# EAGLE schematic D2K_V1 (EAGLE 9.6.2)

## Sheet 1 of 3
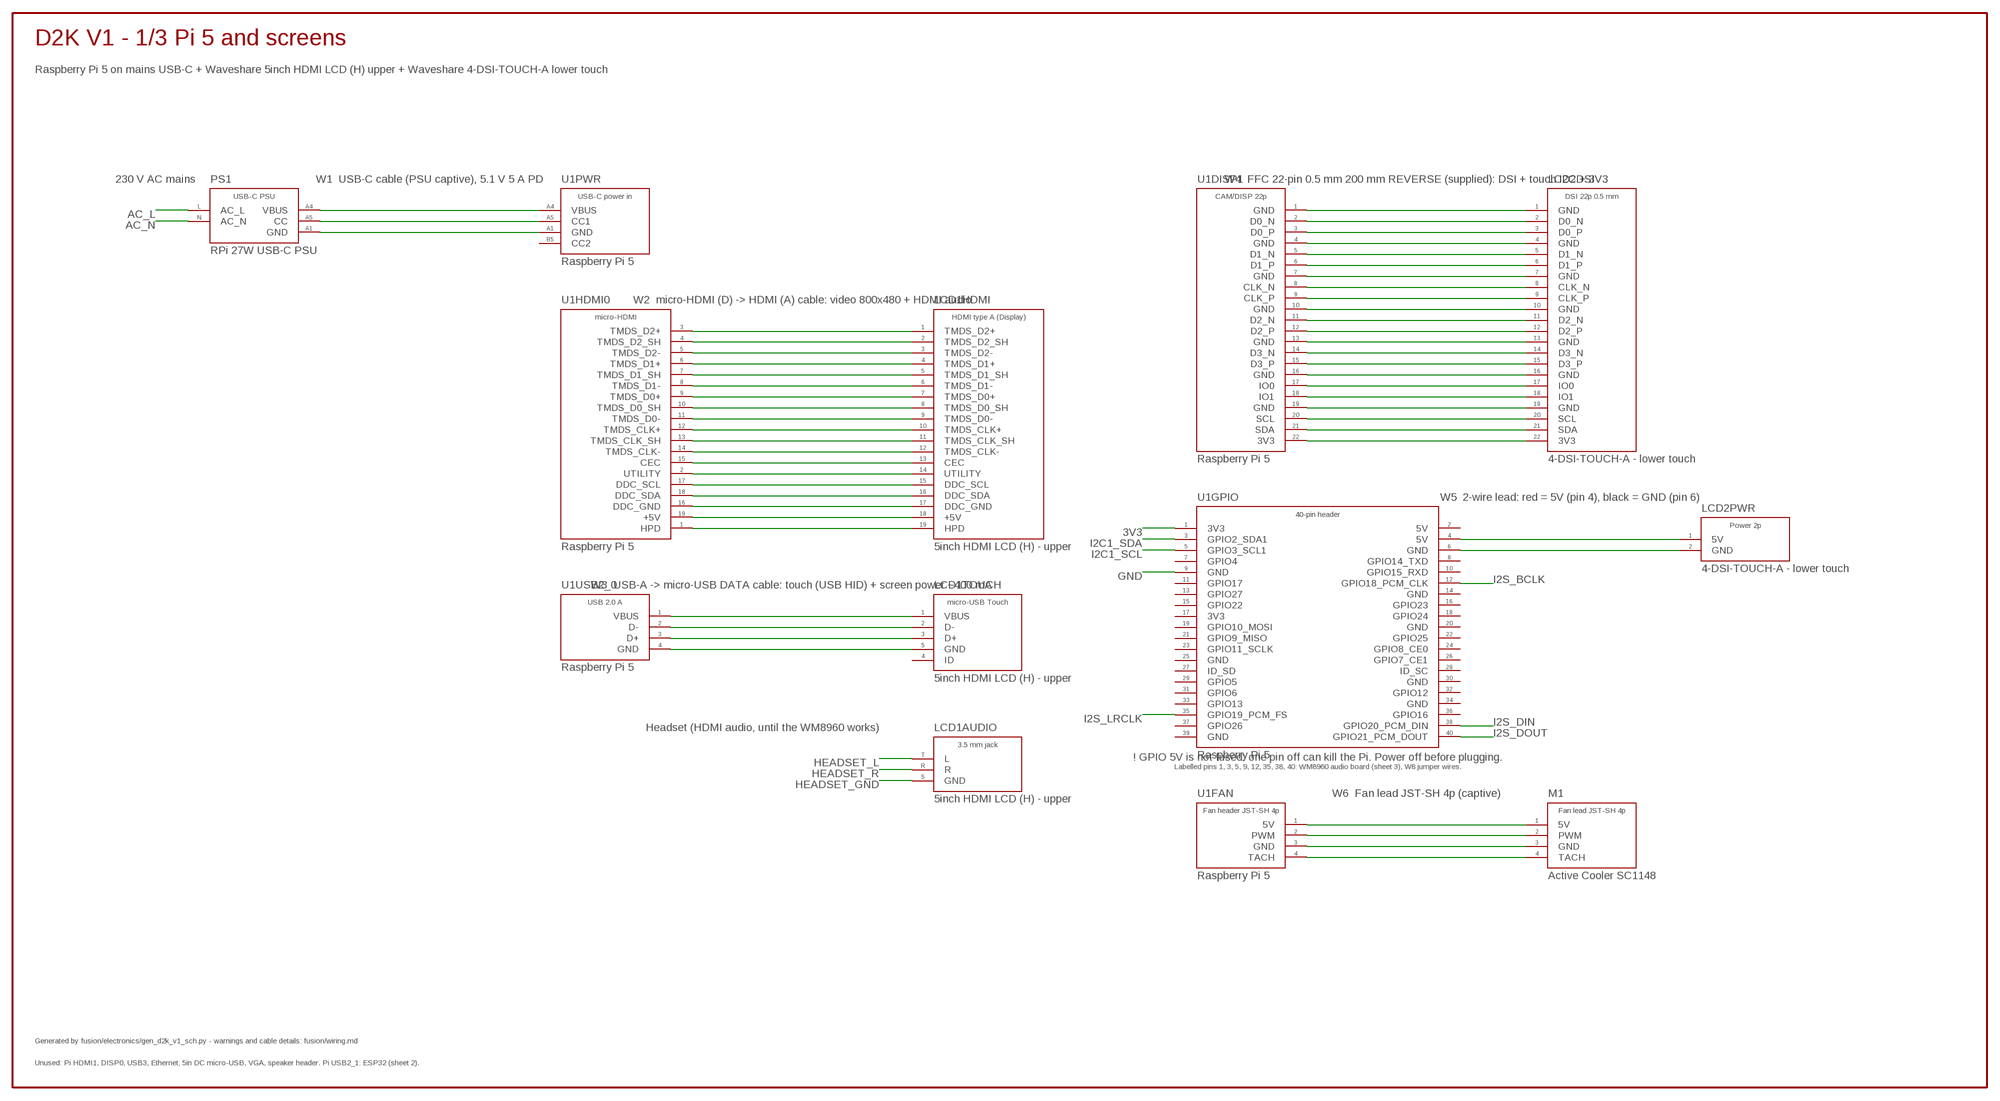
[diagram p0: schematic, sheet 1]

### Parts
LCD1  5inch HDMI LCD (H) - upper  WAVESHARE_5IN_HDMI_LCD_H  (no package)
LCD2  4-DSI-TOUCH-A - lower touch  WAVESHARE_4_DSI_TOUCH_A  (no package)
M1  Active Cooler SC1148  RPI5_ACTIVE_COOLER  (no package)
PS1  RPi 27W USB-C PSU  PSU_USBC_27W  (no package)
U1  Raspberry Pi 5  RASPBERRY_PI_5  (no package)

### Nets
3V3: LCD2.3V3 U1.3V3 ; also sheet 3
5V: LCD2.5V U1.5V
AC_L: PS1.AC_L
AC_N: PS1.AC_N
DSI1_CLK_N: LCD2.CLK_N U1.CLK_N
DSI1_CLK_P: LCD2.CLK_P U1.CLK_P
DSI1_D0_N: LCD2.D0_N U1.D0_N
DSI1_D0_P: LCD2.D0_P U1.D0_P
DSI1_D1_N: LCD2.D1_N U1.D1_N
DSI1_D1_P: LCD2.D1_P U1.D1_P
DSI1_D2_N: LCD2.D2_N U1.D2_N
DSI1_D2_P: LCD2.D2_P U1.D2_P
DSI1_D3_N: LCD2.D3_N U1.D3_N
DSI1_D3_P: LCD2.D3_P U1.D3_P
DSI1_IO0: LCD2.IO0 U1.IO0
DSI1_IO1: LCD2.IO1 U1.IO1
DSI1_SCL: LCD2.SCL U1.SCL
DSI1_SDA: LCD2.SDA U1.SDA
FAN_5V: M1.5V U1.5V
FAN_PWM: M1.PWM U1.PWM
FAN_TACH: M1.TACH U1.TACH
GND: LCD1.DDC_GND LCD1.GND LCD1.TMDS_CLK_SH LCD1.TMDS_D0_SH LCD1.TMDS_D1_SH LCD1.TMDS_D2_SH LCD2.GND M1.GND PS1.GND U1.DDC_GND U1.GND U1.TMDS_CLK_SH U1.TMDS_D0_SH U1.TMDS_D1_SH U1.TMDS_D2_SH ; also sheet 2,3
HDMI0_+5V: LCD1.+5V U1.+5V
HDMI0_CEC: LCD1.CEC U1.CEC
HDMI0_DDC_SCL: LCD1.DDC_SCL U1.DDC_SCL
HDMI0_DDC_SDA: LCD1.DDC_SDA U1.DDC_SDA
HDMI0_HPD: LCD1.HPD U1.HPD
HDMI0_TMDS_CLK+: LCD1.TMDS_CLK+ U1.TMDS_CLK+
HDMI0_TMDS_CLK-: LCD1.TMDS_CLK- U1.TMDS_CLK-
HDMI0_TMDS_D0+: LCD1.TMDS_D0+ U1.TMDS_D0+
HDMI0_TMDS_D0-: LCD1.TMDS_D0- U1.TMDS_D0-
HDMI0_TMDS_D1+: LCD1.TMDS_D1+ U1.TMDS_D1+
HDMI0_TMDS_D1-: LCD1.TMDS_D1- U1.TMDS_D1-
HDMI0_TMDS_D2+: LCD1.TMDS_D2+ U1.TMDS_D2+
HDMI0_TMDS_D2-: LCD1.TMDS_D2- U1.TMDS_D2-
HDMI0_UTILITY: LCD1.UTILITY U1.UTILITY
HEADSET_GND: LCD1.GND
HEADSET_L: LCD1.L
HEADSET_R: LCD1.R
I2C1_SCL: U1.GPIO3_SCL1 ; also sheet 3
I2C1_SDA: U1.GPIO2_SDA1 ; also sheet 3
I2S_BCLK: U1.GPIO18_PCM_CLK ; also sheet 3
I2S_DIN: U1.GPIO20_PCM_DIN ; also sheet 3
I2S_DOUT: U1.GPIO21_PCM_DOUT ; also sheet 3
I2S_LRCLK: U1.GPIO19_PCM_FS ; also sheet 3
USB2_0_D+: LCD1.D+ U1.D+
USB2_0_D-: LCD1.D- U1.D-
USB2_0_VBUS: LCD1.VBUS U1.VBUS
USBC_CC: PS1.CC U1.CC1
VBUS_5V1: PS1.VBUS U1.VBUS
Unconnected: LCD1.GND LCD1.ID LCD1.SPK1 LCD1.SPK2 LCD1.SPK3 LCD1.SPK4 LCD1.VBUS U1.3V3 U1.5V U1.+5V U1.CC2 U1.CEC U1.CLK_N U1.CLK_P U1.D0_N U1.D0_P U1.D1_N U1.D1_P U1.D2_N U1.D2_P U1.D3_N U1.D3_P U1.D+ U1.D- U1.DDC_GND U1.DDC_SCL U1.DDC_SDA U1.GND U1.GND_DRAIN U1.GPIO4 U1.GPIO5 U1.GPIO6 U1.GPIO7_CE1 U1.GPIO8_CE0 U1.GPIO9_MISO U1.GPIO10_MOSI U1.GPIO11_SCLK U1.GPIO12 U1.GPIO13 U1.GPIO14_TXD U1.GPIO15_RXD U1.GPIO16 U1.GPIO17 U1.GPIO22 U1.GPIO23 U1.GPIO24 U1.GPIO25 U1.GPIO26 U1.GPIO27 U1.HPD U1.ID_SC U1.ID_SD U1.IO0 U1.IO1 U1.SCL U1.SDA U1.SSRX+ U1.SSRX- U1.SSTX+ U1.SSTX- U1.TMDS_CLK+ U1.TMDS_CLK- U1.TMDS_CLK_SH U1.TMDS_D0+ U1.TMDS_D0- U1.TMDS_D0_SH U1.TMDS_D1+ U1.TMDS_D1- U1.TMDS_D1_SH U1.TMDS_D2+ U1.TMDS_D2- U1.TMDS_D2_SH U1.UTILITY U1.VBUS

### Notes on the sheet
- D2K V1 - 1/3 Pi 5 and screens
- Raspberry Pi 5 on mains USB-C + Waveshare 5inch HDMI LCD (H) upper + Waveshare 4-DSI-TOUCH-A lower touch
- 230 V AC mains | W1  USB-C cable (PSU captive), 5.1 V 5 A PD | W4  FFC 22-pin 0.5 mm 200 mm REVERSE (supplied): DSI + touch I2C + 3V3
- W2  micro-HDMI (D) -> HDMI (A) cable: video 800x480 + HDMI audio
- W5  2-wire lead: red = 5V (pin 4), black = GND (pin 6)
- W3  USB-A -> micro-USB DATA cable: touch (USB HID) + screen power ~400 mA
- Headset (HDMI audio, until the WM8960 works)
- ! GPIO 5V is not fused: one pin off can kill the Pi. Power off before plugging.
- Labelled pins 1, 3, 5, 9, 12, 35, 38, 40: WM8960 audio board (sheet 3), W8 jumper wires.
- W6  Fan lead JST-SH 4p (captive)
- Generated by fusion/electronics/gen_d2k_v1_sch.py - warnings and cable details: fusion/wiring.md
- Unused: Pi HDMI1, DISP0, USB3, Ethernet; 5in DC micro-USB, VGA, speaker header. Pi USB2_1: ESP32 (sheet 2).

## Sheet 2 of 3
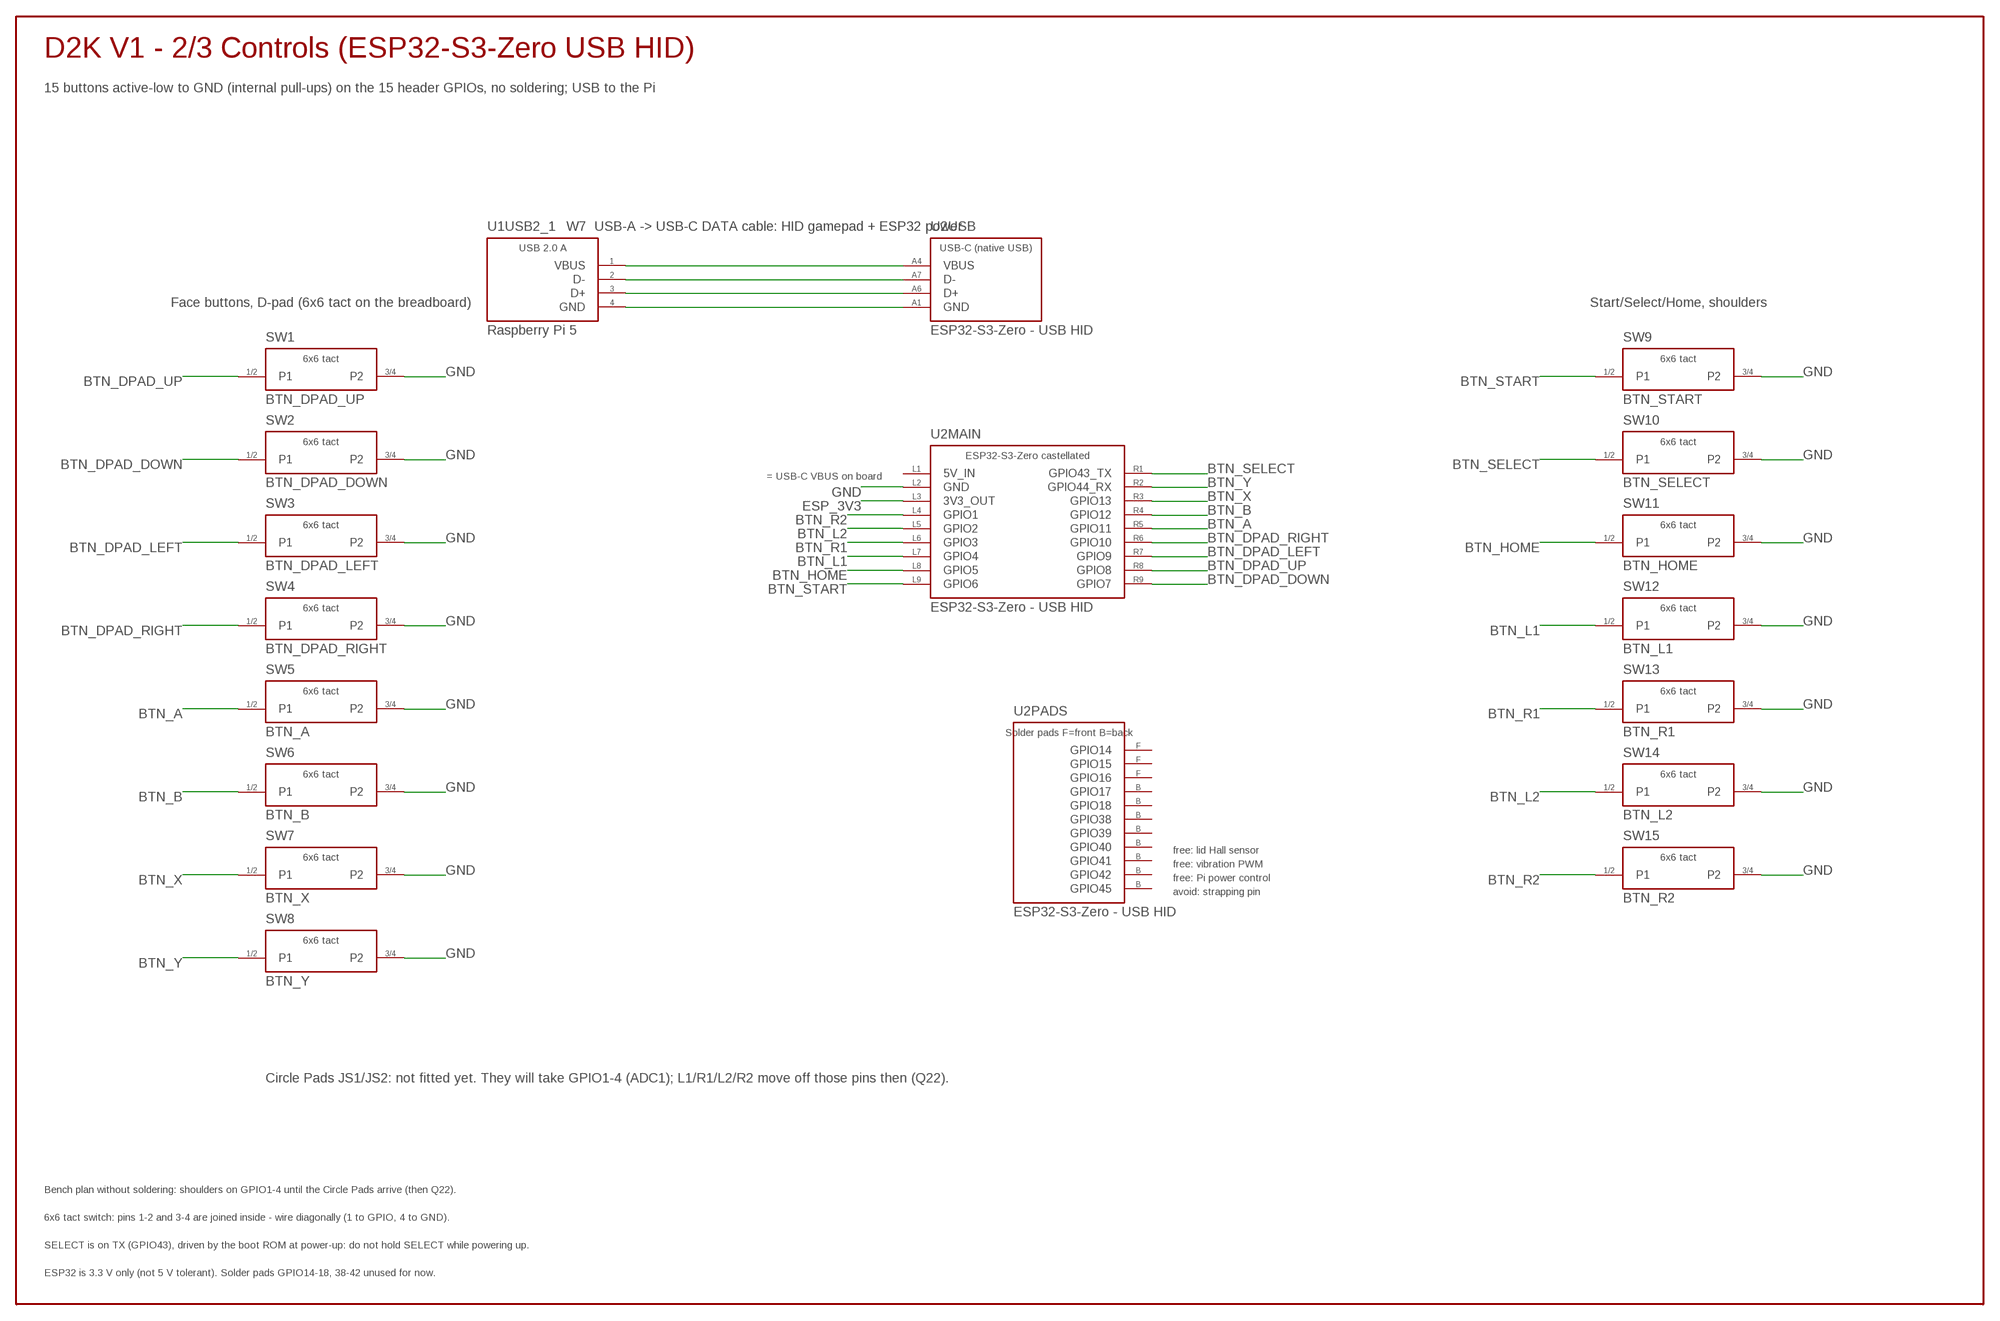
[diagram p1: schematic, sheet 2]

### Parts
SW1  BTN_DPAD_UP  TACT_SWITCH_6X6  (no package)
SW2  BTN_DPAD_DOWN  TACT_SWITCH_6X6  (no package)
SW3  BTN_DPAD_LEFT  TACT_SWITCH_6X6  (no package)
SW4  BTN_DPAD_RIGHT  TACT_SWITCH_6X6  (no package)
SW5  BTN_A  TACT_SWITCH_6X6  (no package)
SW6  BTN_B  TACT_SWITCH_6X6  (no package)
SW7  BTN_X  TACT_SWITCH_6X6  (no package)
SW8  BTN_Y  TACT_SWITCH_6X6  (no package)
SW9  BTN_START  TACT_SWITCH_6X6  (no package)
SW10  BTN_SELECT  TACT_SWITCH_6X6  (no package)
SW11  BTN_HOME  TACT_SWITCH_6X6  (no package)
SW12  BTN_L1  TACT_SWITCH_6X6  (no package)
SW13  BTN_R1  TACT_SWITCH_6X6  (no package)
SW14  BTN_L2  TACT_SWITCH_6X6  (no package)
SW15  BTN_R2  TACT_SWITCH_6X6  (no package)
U2  ESP32-S3-Zero - USB HID  ESP32_S3_ZERO  (no package)

### Nets
BTN_A: SW5.P1 U2.GPIO11
BTN_B: SW6.P1 U2.GPIO12
BTN_DPAD_DOWN: SW2.P1 U2.GPIO7
BTN_DPAD_LEFT: SW3.P1 U2.GPIO9
BTN_DPAD_RIGHT: SW4.P1 U2.GPIO10
BTN_DPAD_UP: SW1.P1 U2.GPIO8
BTN_HOME: SW11.P1 U2.GPIO5
BTN_L1: SW12.P1 U2.GPIO4
BTN_L2: SW14.P1 U2.GPIO2
BTN_R1: SW13.P1 U2.GPIO3
BTN_R2: SW15.P1 U2.GPIO1
BTN_SELECT: SW10.P1 U2.GPIO43_TX
BTN_START: SW9.P1 U2.GPIO6
BTN_X: SW7.P1 U2.GPIO13
BTN_Y: SW8.P1 U2.GPIO44_RX
ESP_3V3: U2.3V3_OUT
GND: SW1.P2 SW2.P2 SW3.P2 SW4.P2 SW5.P2 SW6.P2 SW7.P2 SW8.P2 SW9.P2 SW10.P2 SW11.P2 SW12.P2 SW13.P2 SW14.P2 SW15.P2 U1.GND U2.GND ; also sheet 1,3
USB2_1_D+: U1.D+ U2.D+
USB2_1_D-: U1.D- U2.D-
USB2_1_VBUS: U1.VBUS U2.VBUS
Unconnected: U2.5V_IN U2.GPIO14 U2.GPIO15 U2.GPIO16 U2.GPIO17 U2.GPIO18 U2.GPIO38 U2.GPIO39 U2.GPIO40 U2.GPIO41 U2.GPIO42 U2.GPIO45

### Notes on the sheet
- D2K V1 - 2/3 Controls (ESP32-S3-Zero USB HID)
- 15 buttons active-low to GND (internal pull-ups) on the 15 header GPIOs, no soldering; USB to the Pi
- W7  USB-A -> USB-C DATA cable: HID gamepad + ESP32 power
- Face buttons, D-pad (6x6 tact on the breadboard) | Start/Select/Home, shoulders
- = USB-C VBUS on board
- free: lid Hall sensor
- free: vibration PWM
- free: Pi power control
- avoid: strapping pin
- Circle Pads JS1/JS2: not fitted yet. They will take GPIO1-4 (ADC1); L1/R1/L2/R2 move off those pins then (Q22).
- Bench plan without soldering: shoulders on GPIO1-4 until the Circle Pads arrive (then Q22).
- 6x6 tact switch: pins 1-2 and 3-4 are joined inside - wire diagonally (1 to GPIO, 4 to GND).
- SELECT is on TX (GPIO43), driven by the boot ROM at power-up: do not hold SELECT while powering up.
- ESP32 is 3.3 V only (not 5 V tolerant). Solder pads GPIO14-18, 38-42 unused for now.

## Sheet 3 of 3
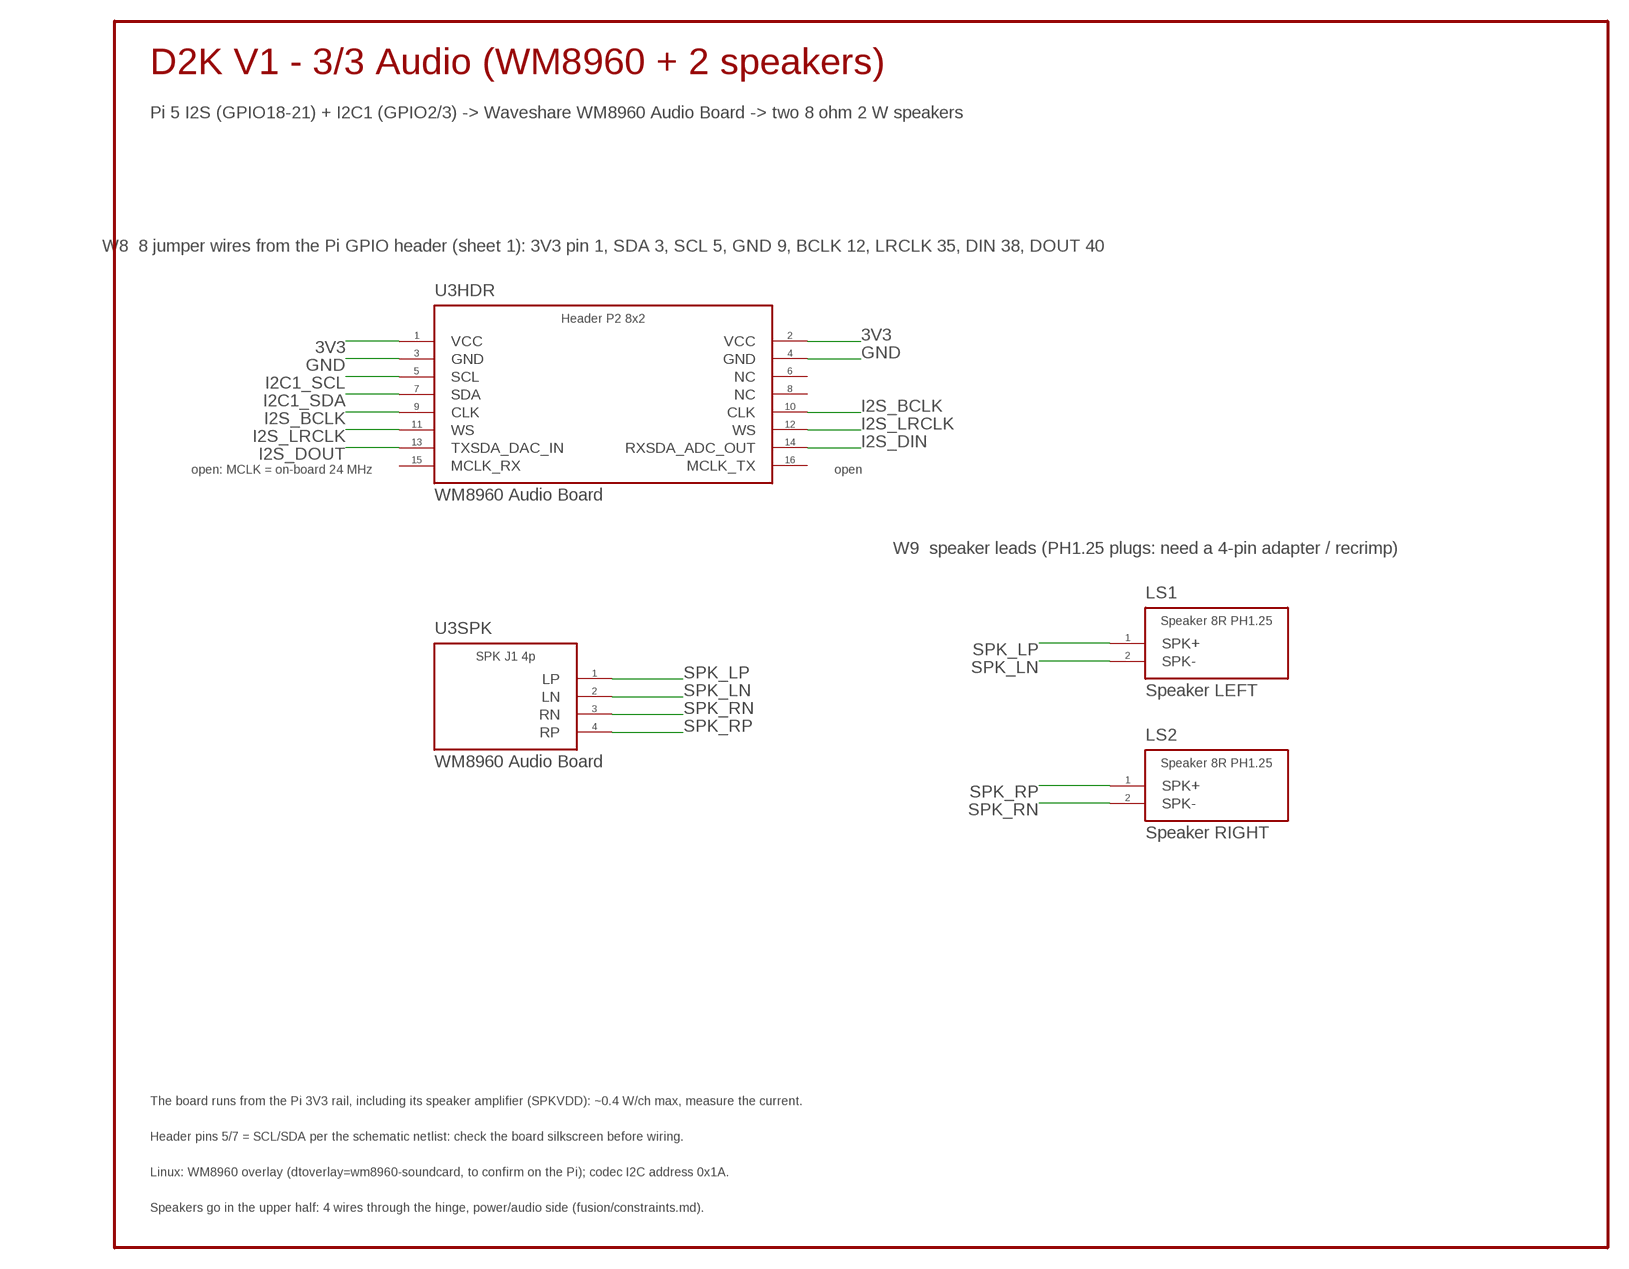
[diagram p2: schematic, sheet 3]

### Parts
LS1  Speaker LEFT  SPEAKER_8R_2W  (no package)
LS2  Speaker RIGHT  SPEAKER_8R_2W  (no package)
U3  WM8960 Audio Board  WM8960_AUDIO_BOARD  (no package)

### Nets
3V3: U3.VCC ; also sheet 1
GND: U3.GND ; also sheet 1,2
I2C1_SCL: U3.SCL ; also sheet 1
I2C1_SDA: U3.SDA ; also sheet 1
I2S_BCLK: U3.CLK ; also sheet 1
I2S_DIN: U3.RXSDA_ADC_OUT ; also sheet 1
I2S_DOUT: U3.TXSDA_DAC_IN ; also sheet 1
I2S_LRCLK: U3.WS ; also sheet 1
SPK_LN: LS1.SPK- U3.LN
SPK_LP: LS1.SPK+ U3.LP
SPK_RN: LS2.SPK- U3.RN
SPK_RP: LS2.SPK+ U3.RP
Unconnected: U3.MCLK_RX U3.MCLK_TX U3.NC

### Notes on the sheet
- D2K V1 - 3/3 Audio (WM8960 + 2 speakers)
- Pi 5 I2S (GPIO18-21) + I2C1 (GPIO2/3) -> Waveshare WM8960 Audio Board -> two 8 ohm 2 W speakers
- W8  8 jumper wires from the Pi GPIO header (sheet 1): 3V3 pin 1, SDA 3, SCL 5, GND 9, BCLK 12, LRCLK 35, DIN 38, DOUT 40
- open: MCLK = on-board 24 MHz | open
- W9  speaker leads (PH1.25 plugs: need a 4-pin adapter / recrimp)
- The board runs from the Pi 3V3 rail, including its speaker amplifier (SPKVDD): ~0.4 W/ch max, measure the current.
- Header pins 5/7 = SCL/SDA per the schematic netlist: check the board silkscreen before wiring.
- Linux: WM8960 overlay (dtoverlay=wm8960-soundcard, to confirm on the Pi); codec I2C address 0x1A.
- Speakers go in the upper half: 4 wires through the hinge, power/audio side (fusion/constraints.md).

## Library data of the parts
LCD1 = D2K:WAVESHARE_5IN_HDMI_LCD_H: Waveshare 5inch HDMI LCD (H): 800x480 TFT, 5-point capacitive USB touch, toughened glass, RTD2660 scaler. D2K upper screen. PCB/glass 121 x 76 mm, holes 109 x 84. Connector pin = signal: HDMI (HDMI type A (Display)): 1=TMDS_D2+, 2=TMDS_D2_SH, 3=TMDS_D2-, 4=TMDS_D1+, 5=TMDS_D1_SH, 6=TMDS_D1-, 7=TMDS_D0+, 8=TMDS_D0_SH, 9=TMDS_D0-, 10=TMDS_CLK+, 11=TMDS_CLK_SH, 12=TMDS_CLK-, 13=CEC, 14=UTILITY, 15=DDC_SCL, 16=DDC_SDA, 17=DDC_GND, 18=+5V, 19=HPD TOUCH (micro-USB Touch): 1=VBUS, 2=D-, 3=D+, 5=GND, 4=ID DC (micro-USB DC power): 1=VBUS, 5=GND AUDIO (3.5 mm jack): T=L, R=R, S=GND SPK (Speaker header 4p): 1=SPK1, 2=SPK2, 3=SPK3, 4=SPK4; AUDIO: HDMI audio to 3.5 mm jack and 4-pin speaker header; DOC: https://www.waveshare.com/wiki/5inch_HDMI_LCD_(H); MANUFACTURER: Waveshare; MPN: 5inch HDMI LCD (H); RESOLUTION: 800x480 @ 60 Hz; SUPPLY: 5 V, about 400 mA, from DC micro-USB or the Touch micro-USB; TOUCH: USB HID, 5-point capacitive; VERIFY: Speaker header pin order not published: identify L/R before wiring speakers
LCD2 = D2K:WAVESHARE_4_DSI_TOUCH_A: Waveshare 4-DSI-TOUCH-A (SKU 34354): 4inch IPS 480x800 (landscape 800x480), MIPI DSI, 5-point capacitive touch, optical bonding, aluminium back. D2K lower touch screen. Outline 108.3 x 65.1 x 5.8 mm, AA 86.4 x 51.84, 8x M2.5 (corners 100 x 56, Pi pattern 58 x 49). Connector pin = signal: DSI (DSI 22p 0.5 mm): 1=GND, 2=D0_N, 3=D0_P, 4=GND, 5=D1_N, 6=D1_P, 7=GND, 8=CLK_N, 9=CLK_P, 10=GND, 11=D2_N, 12=D2_P, 13=GND, 14=D3_N, 15=D3_P, 16=GND, 17=IO0, 18=IO1, 19=GND, 20=SCL, 21=SDA, 22=3V3 PWR (Power 2p): 1=5V, 2=GND; CABLE: FFC 22-pin 0.5 mm 200 mm reverse (supplied); DOC: https://www.waveshare.com/4-dsi-touch-a.htm; MANUFACTURER: Waveshare; MPN: 4-DSI-TOUCH-A; OVERLAY: dtoverlay=vc4-kms-dsi-waveshare-panel-v2,4_0_inch_a (add ,dsi0 on DISP0); SKU: 34354; SUPPLY: 4.75-5.25 V, 180 mA typ, via 2-wire lead to Pi GPIO 5V/GND; TOUCH: Goodix, I2C 0x14 on the DSI cable I2C (i2c-10 on Pi 5)
LS1 LS2 = D2K:SPEAKER_8R_2W: Waveshare 2030 Cavity Speaker Type B (SKU 27859): 8 ohm 2 W, 20 x 30 x 6.8 mm, 2-pin PH1.25 plug on ~120 mm wires (does not mate with the WM8960 board's 4-pin SPK header). Connector pin = signal: S (Speaker 8R PH1.25): 1=SPK+, 2=SPK-; DOC: https://www.waveshare.com/8ohm-2w-speaker-b.htm; MANUFACTURER: Waveshare; MPN: 2030 Cavity Speaker Type B; SKU: 27859
M1 = D2K:RPI5_ACTIVE_COOLER: Raspberry Pi Active Cooler for Pi 5 (SC1148). 63.5 x 42.5 x 13.7 mm, blower fan, PWM + tach, 5 V from the Pi fan header. Connector pin = signal: FAN (Fan lead JST-SH 4p): 1=5V, 2=PWM, 3=GND, 4=TACH; DOC: https://pip.raspberrypi.com/documents/RP-008188-DS-raspberry-pi-active-cooler-product-brief.pdf; MANUFACTURER: Raspberry Pi Ltd; MPN: SC1148; SUPPLY: 5 V from Pi FAN header
PS1 = D2K:PSU_USBC_27W: Raspberry Pi 27 W USB-C power supply (mains). V1 bench power: 5.1 V 5 A, PD 9 V 3 A / 12 V 2.25 A / 15 V 1.8 A. Connector pin = signal: P (USB-C PSU): L=AC_L, N=AC_N, A4=VBUS, A5=CC, A1=GND; INPUT: 100-240 V AC; MANUFACTURER: Raspberry Pi Ltd; MPN: 27W USB-C PSU; OUTPUT: 5.1 V 5 A (PD)
SW1-SW15 = D2K:TACT_SWITCH_6X6: 6 x 6 mm through-hole tact switch (bench stand-in for the New 3DS XL membrane buttons). Pins 1-2 and 3-4 are joined inside; the switch closes 1/2 to 3/4. Connector pin = signal: S (6x6 tact): 1/2=P1, 3/4=P2; MPN: 6x6 tact switch; VERIFY: Check which pin pairs are joined with a multimeter
U1 = D2K:RASPBERRY_PI_5: Raspberry Pi 5 (4/8 GB). D2K V1 compute. Board 85 x 56 mm, 4x M2.5 on 58 x 49. Connector pin = signal: PWR (USB-C power in): A4=VBUS, A5=CC1, A1=GND, B5=CC2 HDMI0 (micro-HDMI): 3=TMDS_D2+, 4=TMDS_D2_SH, 5=TMDS_D2-, 6=TMDS_D1+, 7=TMDS_D1_SH, 8=TMDS_D1-, 9=TMDS_D0+, 10=TMDS_D0_SH, 11=TMDS_D0-, 12=TMDS_CLK+, 13=TMDS_CLK_SH, 14=TMDS_CLK-, 15=CEC, 2=UTILITY, 17=DDC_SCL, 18=DDC_SDA, 16=DDC_GND, 19=+5V, 1=HPD HDMI1 (micro-HDMI): 3=TMDS_D2+, 4=TMDS_D2_SH, 5=TMDS_D2-, 6=TMDS_D1+, 7=TMDS_D1_SH, 8=TMDS_D1-, 9=TMDS_D0+, 10=TMDS_D0_SH, 11=TMDS_D0-, 12=TMDS_CLK+, 13=TMDS_CLK_SH, 14=TMDS_CLK-, 15=CEC, 2=UTILITY, 17=DDC_SCL, 18=DDC_SDA, 16=DDC_GND, 19=+5V, 1=HPD DISP0 (CAM/DISP 22p): 1=GND, 2=D0_N, 3=D0_P, 4=GND, 5=D1_N, 6=D1_P, 7=GND, 8=CLK_N, 9=CLK_P, 10=GND, 11=D2_N, 12=D2_P, 13=GND, 14=D3_N, 15=D3_P, 16=GND, 17=IO0, 18=IO1, 19=GND, 20=SCL, 21=SDA, 22=3V3 DISP1 (CAM/DISP 22p): 1=GND, 2=D0_N, 3=D0_P, 4=GND, 5=D1_N, 6=D1_P, 7=GND, 8=CLK_N, 9=CLK_P, 10=GND, 11=D2_N, 12=D2_P, 13=GND, 14=D3_N, 15=D3_P, 16=GND, 17=IO0, 18=IO1, 19=GND, 20=SCL, 21=SDA, 22=3V3 GPIO (40-pin header): 1=3V3, 2=5V, 3=GPIO2_SDA1, 4=5V, 5=GPIO3_SCL1, 6=GND, 7=GPIO4, 8=GPIO14_TXD, 9=GND, 10=GPIO15_RXD, 11=GPIO17, 12=GPIO18_PCM_CLK, 13=GPIO27, 14=GND, 15=GPIO22, 16=GPIO23, 17=3V3, 18=GPIO24, 19=GPIO10_MOSI, 20=GND, 21=GPIO9_MISO, 22=GPIO25, 23=GPIO11_SCLK, 24=GPIO8_CE0, 25=GND, 26=GPIO7_CE1, 27=ID_SD, 28=ID_SC, 29=GPIO5, 30=GND, 31=GPIO6, 32=GPIO12, 33=GPIO13, 34=GND, 35=GPIO19_PCM_FS, 36=GPIO16, 37=GPIO26, 38=GPIO20_PCM_DIN, 39=GND, 40=GPIO21_PCM_DOUT USB2_0 (USB 2.0 A): 1=VBUS, 2=D-, 3=D+, 4=GND USB2_1 (USB 2.0 A): 1=VBUS, 2=D-, 3=D+, 4=GND USB3_0 (USB 3.0 A): 1=VBUS, 2=D-, 3=D+, 4=GND, 5=SSRX-, 6=SSRX+, 7=GND_DRAIN, 8=SSTX-, 9=SSTX+ USB3_1 (USB 3.0 A): 1=VBUS, 2=D-, 3=D+, 4=GND, 5=SSRX-, 6=SSRX+, 7=GND_DRAIN, 8=SSTX-, 9=SSTX+ FAN (Fan header JST-SH 4p): 1=5V, 2=PWM, 3=GND, 4=TACH; DOC: https://datasheets.raspberrypi.com/rpi5/raspberry-pi-5-mechanical-drawing.pdf; MANUFACTURER: Raspberry Pi Ltd; MPN: Raspberry Pi 5; SUPPLY: 5.1 V USB-C PD, 5 A (27 W PSU); USB_BUDGET: 1.6 A total on the 4 USB-A ports with a 5 A PSU, 600 mA otherwise; VERIFY: MIPI_22 IO0/IO1 roles and FAN pin order are from the generic RPi pinout, check before wiring
U2 = D2K:ESP32_S3_ZERO: Waveshare ESP32-S3-Zero (ESP32-S3FH4R2, 4 MB flash, 2 MB PSRAM). D2K embedded controller: USB HID gamepad to the Pi. 18 x 23.5 mm, 2 x 9 castellated pins 2.54 mm pitch, rows 15.24 mm apart (fits a breadboard). On board: WS2812 on GPIO21, BOOT on GPIO0, native USB on GPIO19/20 (USB-C). GPIO33-37 used by the PSRAM. ADC1 = GPIO1-10. Strapping: GPIO0, 3, 45, 46. Connector pin = signal: MAIN (ESP32-S3-Zero castellated): L1=5V_IN, L2=GND, L3=3V3_OUT, L4=GPIO1, L5=GPIO2, L6=GPIO3, L7=GPIO4, L8=GPIO5, L9=GPIO6, R1=GPIO43_TX, R2=GPIO44_RX, R3=GPIO13, R4=GPIO12, R5=GPIO11, R6=GPIO10, R7=GPIO9, R8=GPIO8, R9=GPIO7 PADS (Solder pads F=front B=back): F=GPIO14, F=GPIO15, F=GPIO16, B=GPIO17, B=GPIO18, B=GPIO38, B=GPIO39, B=GPIO40, B=GPIO41, B=GPIO42, B=GPIO45 USB (USB-C (native USB)): A4=VBUS, A7=D-, A6=D+, A1=GND; DOC: https://www.waveshare.com/wiki/ESP32-S3-Zero; LOGIC: 3.3 V, not 5 V tolerant; MANUFACTURER: Waveshare; MPN: ESP32-S3-Zero; SUPPLY: 5V pin / USB-C 3.7-6 V, >= 500 mA; 3V3_OUT from the on-board LDO
U3 = D2K:WM8960_AUDIO_BOARD: Waveshare WM8960 Audio Board (SKU 15019): WM8960 codec, I2C control (0x1A), I2S audio, 24 MHz crystal as MCLK, 1 W/ch class-D speaker outputs (8 ohm), 3.5 mm headset jack, MEMS mic. Runs from 3.3 V only: the speaker supply (SPKVDD) is the same 3.3 V rail. Connector pin = signal: HDR (Header P2 8x2): 1=VCC, 2=VCC, 3=GND, 4=GND, 5=SCL, 6=NC, 7=SDA, 8=NC, 9=CLK, 10=CLK, 11=WS, 12=WS, 13=TXSDA_DAC_IN, 14=RXSDA_ADC_OUT, 15=MCLK_RX, 16=MCLK_TX SPK (SPK J1 4p): 1=LP, 2=LN, 3=RN, 4=RP; DOC: https://www.waveshare.com/wiki/WM8960_Audio_Board; I2C_ADDR: 0x1A; MANUFACTURER: Waveshare; MPN: WM8960 Audio Board; SKU: 15019; SPEAKER: 8 ohm, 1 W/ch at 5 V SPKVDD; ~0.4 W/ch at the board's 3.3 V; SUPPLY: 3.3 V (logic, codec AND speaker amplifier); VERIFY: Header pins 5/7 (SCL/SDA) from the schematic netlist: check the silkscreen